# Altium schematic sheet brushed_motor_drivers.SchDoc
size A4
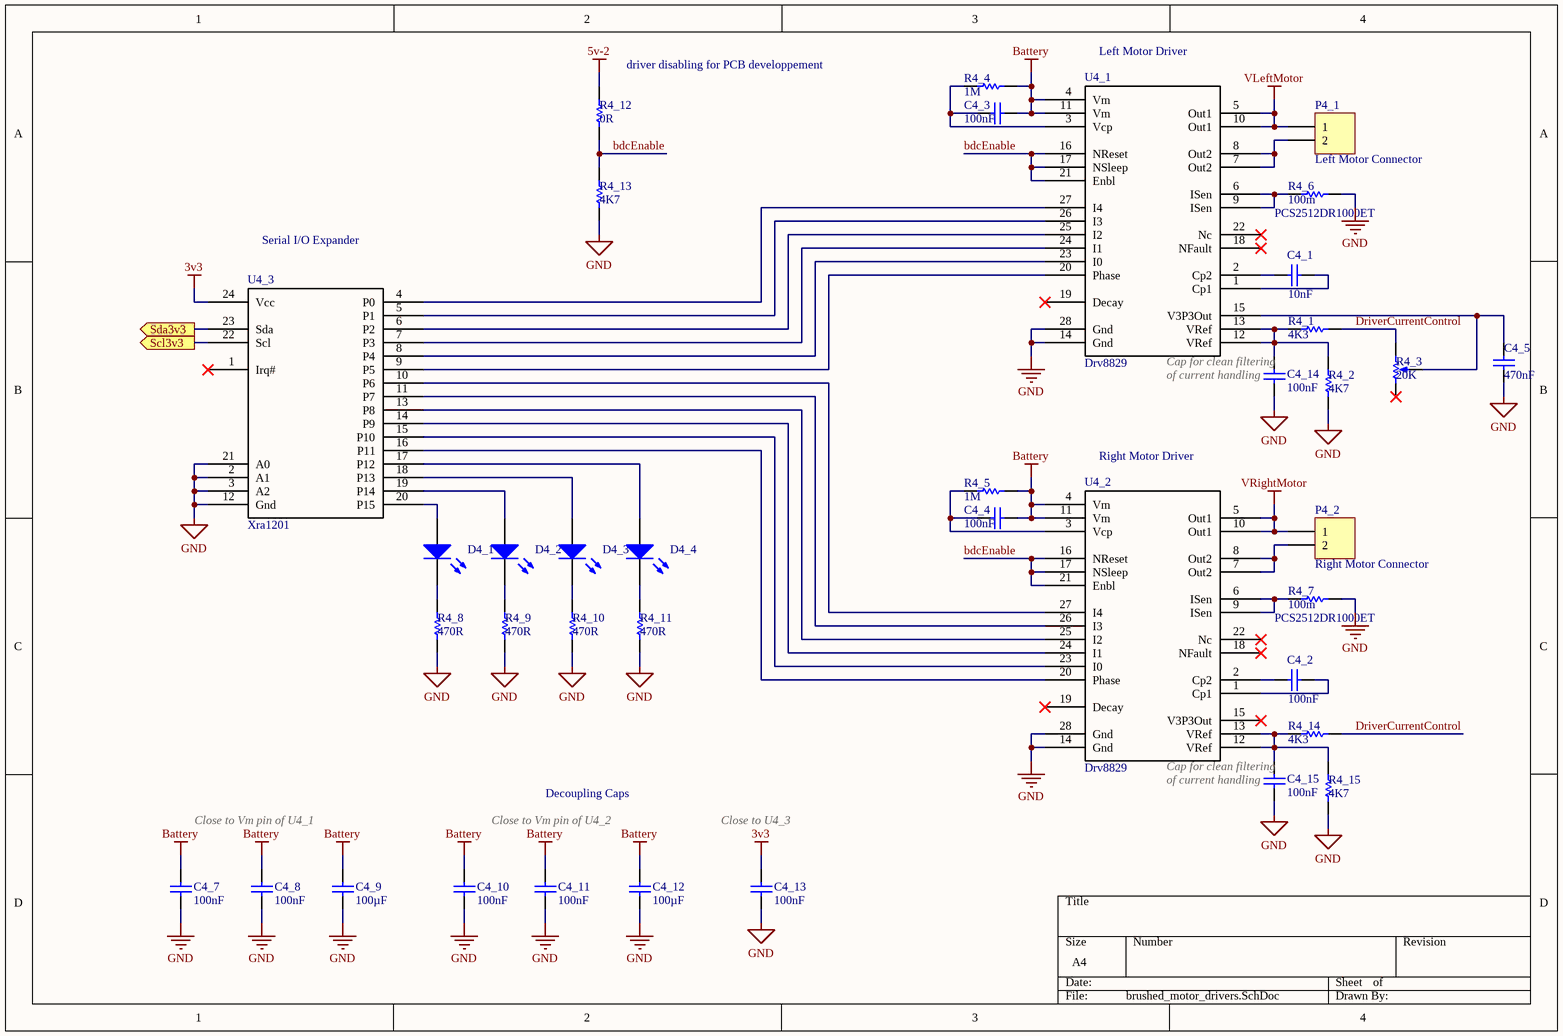
[diagram p0: brushed_motor_drivers.SchDoc]

## Parts
C4_1  value 10nF  [C1206]  (hidden comment: C1206C103M5RACTU)
C4_2  value 100nF  [C1206]  (hidden comment: C1206C103M5RACTU)
C4_3  value 100nF  [C1206]  (hidden comment: 12063C104MAT2A)
C4_4  value 100nF  [C1206]  (hidden comment: 12063C104MAT2A)
C4_5  value 470nF  [C1206]  (hidden comment: C1206C474M5RECAUTO)
C4_7  value 100nF  [C1206]  (hidden comment: 12063C104MAT2A)
C4_8  value 100nF  [C1206]  (hidden comment: 12063C104MAT2A)
C4_9  value 100µF  [CAP-ELECTRO-530530]  (hidden comment: 107AXZ016MQ5)
C4_10  value 100nF  [C1206]  (hidden comment: 12063C104MAT2A)
C4_11  value 100nF  [C1206]  (hidden comment: 12063C104MAT2A)
C4_12  value 100µF  [CAP-ELECTRO-530530]  (hidden comment: 107AXZ016MQ5)
C4_13  value 100nF  [C1206]  (hidden comment: 12063C104MAT2A)
C4_14  value 100nF  [C1206]  (hidden comment: C1206C103M5RACTU)
C4_15  value 100nF  [C1206]  (hidden comment: C1206C103M5RACTU)
D4_1  APT3216QBC/D  [C1206-POLARIZED]  (value not drawn)
D4_2  APT3216QBC/D  [C1206-POLARIZED]  (value not drawn)
D4_3  APT3216QBC/D  [C1206-POLARIZED]  (value not drawn)
D4_4  APT3216QBC/D  [C1206-POLARIZED]  (value not drawn)
P4_1  Left Motor Connector  [HDR1X2-42]
P4_2  Right Motor Connector  [HDR1X2-42]
R4_1  value 4K3  [C1206]  (hidden comment: Res1)
R4_2  value 4K7  [C1206]  (hidden comment: Res1)
R4_3  value 20K  [ST-32EB]  (hidden comment: ST32ETB203)
R4_4  value 1M  [C1206]  (hidden comment: Res1)
R4_5  value 1M  [C1206]  (hidden comment: Res1)
R4_6  PCS2512DR1000ET  value 100m  [2512]
R4_7  PCS2512DR1000ET  value 100m  [2512]
R4_8  value 470R  [C1206]  (hidden comment: Res1)
R4_9  value 470R  [C1206]  (hidden comment: Res1)
R4_10  value 470R  [C1206]  (hidden comment: Res1)
R4_11  value 470R  [C1206]  (hidden comment: Res1)
R4_12  value 0R  [C0805]  (hidden comment: Res1)
R4_13  value 4K7  [C1206]  (hidden comment: Res1)
R4_14  value 4K3  [C1206]  (hidden comment: Res1)
R4_15  value 4K7  [C1206]  (hidden comment: Res1)
U4_1  Drv8829  [SOP65P640X120-28N-GROUND_SINK]
U4_2  Drv8829  [SOP65P640X120-28N-GROUND_SINK]
U4_3  Xra1201  [SOP65P640X110-24N]

## Ports
Scl3v3 (out), Sda3v3 (out)

## Nets
3v3: C4_13.1 U4_3.24(Vcc)
5v-2: R4_12.1
Battery: C4_3.1 C4_4.1 C4_7.1 C4_8.1 C4_9.1 C4_10.1 C4_11.1 C4_12.1 R4_4.2 R4_5.2 U4_1.4(Vm) U4_1.11(Vm) U4_2.4(Vm) U4_2.11(Vm)
GND: C4_5.2 C4_7.2 C4_8.2 C4_9.2 C4_10.2 C4_11.2 C4_12.2 C4_13.2 C4_14.2 C4_15.2 R4_2.2 R4_6.2 R4_7.2 R4_8.2 R4_9.2 R4_10.2 R4_11.2 R4_13.2 R4_15.2 U4_1.14(Gnd) U4_1.28(Gnd) U4_2.14(Gnd) U4_2.28(Gnd) U4_3.2(A1) U4_3.3(A2) U4_3.12(Gnd) U4_3.21(A0)
VLeftMotor: P4_1.1 U4_1.5(Out1) U4_1.10(Out1)
VRightMotor: P4_2.1 U4_2.5(Out1) U4_2.10(Out1)
bdcEnable: R4_12.2 R4_13.1 U4_1.16(NReset) U4_1.17(NSleep) U4_1.21(Enbl) U4_2.16(NReset) U4_2.17(NSleep) U4_2.21(Enbl)
DriverCurrentControl: R4_1.2 R4_3.2(BOT) R4_14.2
Scl3v3: U4_3.22(Scl) ; port Scl3v3
Sda3v3: U4_3.23(Sda) ; port Sda3v3
NetC4_1_1: C4_1.1 U4_1.1(Cp1)
NetC4_1_2: C4_1.2 U4_1.2(Cp2)
NetC4_2_1: C4_2.1 U4_2.1(Cp1)
NetC4_2_2: C4_2.2 U4_2.2(Cp2)
NetC4_3_2: C4_3.2 R4_4.1 U4_1.3(Vcp)
NetC4_4_2: C4_4.2 R4_5.1 U4_2.3(Vcp)
NetC4_5_1: C4_5.1 R4_3.3(TAP) U4_1.15(V3P3Out)
NetC4_14_1: C4_14.1 R4_1.1 R4_2.1 U4_1.12(VRef) U4_1.13(VRef)
NetC4_15_1: C4_15.1 R4_14.1 R4_15.1 U4_2.12(VRef) U4_2.13(VRef)
NetD4_1_1: D4_1.1(A) U4_3.20(P15)
NetD4_1_2: D4_1.2(K) R4_8.1
NetD4_2_1: D4_2.1(A) U4_3.19(P14)
NetD4_2_2: D4_2.2(K) R4_9.1
NetD4_3_1: D4_3.1(A) U4_3.18(P13)
NetD4_3_2: D4_3.2(K) R4_10.1
NetD4_4_1: D4_4.1(A) U4_3.17(P12)
NetD4_4_2: D4_4.2(K) R4_11.1
NetP4_1_2: P4_1.2 U4_1.7(Out2) U4_1.8(Out2)
NetP4_2_2: P4_2.2 U4_2.7(Out2) U4_2.8(Out2)
NetR4_6_1: R4_6.1 U4_1.6(ISen) U4_1.9(ISen)
NetR4_7_1: R4_7.1 U4_2.6(ISen) U4_2.9(ISen)
NetU4_1_20: U4_1.20(Phase) U4_3.9(P5)
NetU4_1_23: U4_1.23(I0) U4_3.8(P4)
NetU4_1_24: U4_1.24(I1) U4_3.7(P3)
NetU4_1_25: U4_1.25(I2) U4_3.6(P2)
NetU4_1_26: U4_1.26(I3) U4_3.5(P1)
NetU4_1_27: U4_1.27(I4) U4_3.4(P0)
NetU4_2_20: U4_2.20(Phase) U4_3.16(P11)
NetU4_2_23: U4_2.23(I0) U4_3.15(P10)
NetU4_2_24: U4_2.24(I1) U4_3.14(P9)
NetU4_2_25: U4_2.25(I2) U4_3.13(P8)
NetU4_2_26: U4_2.26(I3) U4_3.11(P7)
NetU4_2_27: U4_2.27(I4) U4_3.10(P6)

Not connected (* = marked no-connect by the designer): R4_3 1(TOP)*; U4_1 18(NFault)* 19(Decay)* 22(Nc)*; U4_2 15(V3P3Out)* 18(NFault)* 19(Decay)* 22(Nc)*; U4_3 1(Irq#)*

## Notes on the sheet
- (near R4_12) driver disabling for PCB developpement
- (near U4_1) Left Motor Driver
- Serial I/O Expander
- (near C4_14) Cap for clean filtering
- (near C4_14) of current handling
- (near U4_2) Right Motor Driver
- (near C4_15) Cap for clean filtering
- (near C4_15) of current handling
- Close to Vm pin of U4_1
- Close to Vm pin of U4_2
- Decoupling Caps
- Close to U4_3

## Library data of the parts
C4_1-C4_5 C4_7-C4_15 = Cap: Capacitor; Published: 8-Jun-2000; LatestRevisionDate: 17-Jul-2002; LatestRevisionNote: Re-released for DXP Platform.; PackageReference: RAD-0.3; Publisher: Altium Limited; PackageDescription: Radial Cap, Thru-Hole; 2 Leads; 0.3 in Pin Spacing
D4_1-D4_4 = LED0: Typical INFRARED GaAs LED; Published: 8-Jun-2000; LatestRevisionDate: 08-Jul-2005; LatestRevisionNote: Mech Layer 1 removed.; PackageReference: LED-0; Publisher: Altium Limited; PackageDescription: LED; 2 Leads
P4_1 P4_2 = Header 2: Header, 2-Pin; LatestRevisionDate: 17-Jul-2002; LatestRevisionNote: Re-released for DXP Platform.; Publisher: Altium Limited
R4_1 R4_2 R4_4-R4_15 = Res1: Resistor; Published: 8-Jun-2000; LatestRevisionDate: 17-Jul-2002; LatestRevisionNote: Re-released for DXP Platform.; PackageReference: AXIAL-0.3; Publisher: Altium Limited; PackageDescription: Axial Device, Thru-Hole; 2 Leads; 0.3 in Pin Spacing
R4_3 = RPot: Potentiometer; Sim Note: Enter the Resistance value and the set point into parameter fields.; Set Position: 0.5; Published: 8-Jun-2000; LatestRevisionDate: 17-Jul-2002; LatestRevisionNote: Re-released for DXP Platform.; PackageReference: VR5; Publisher: Altium Limited; PackageDescription: Variable Resistor, Thru-Hole; 3 Leads